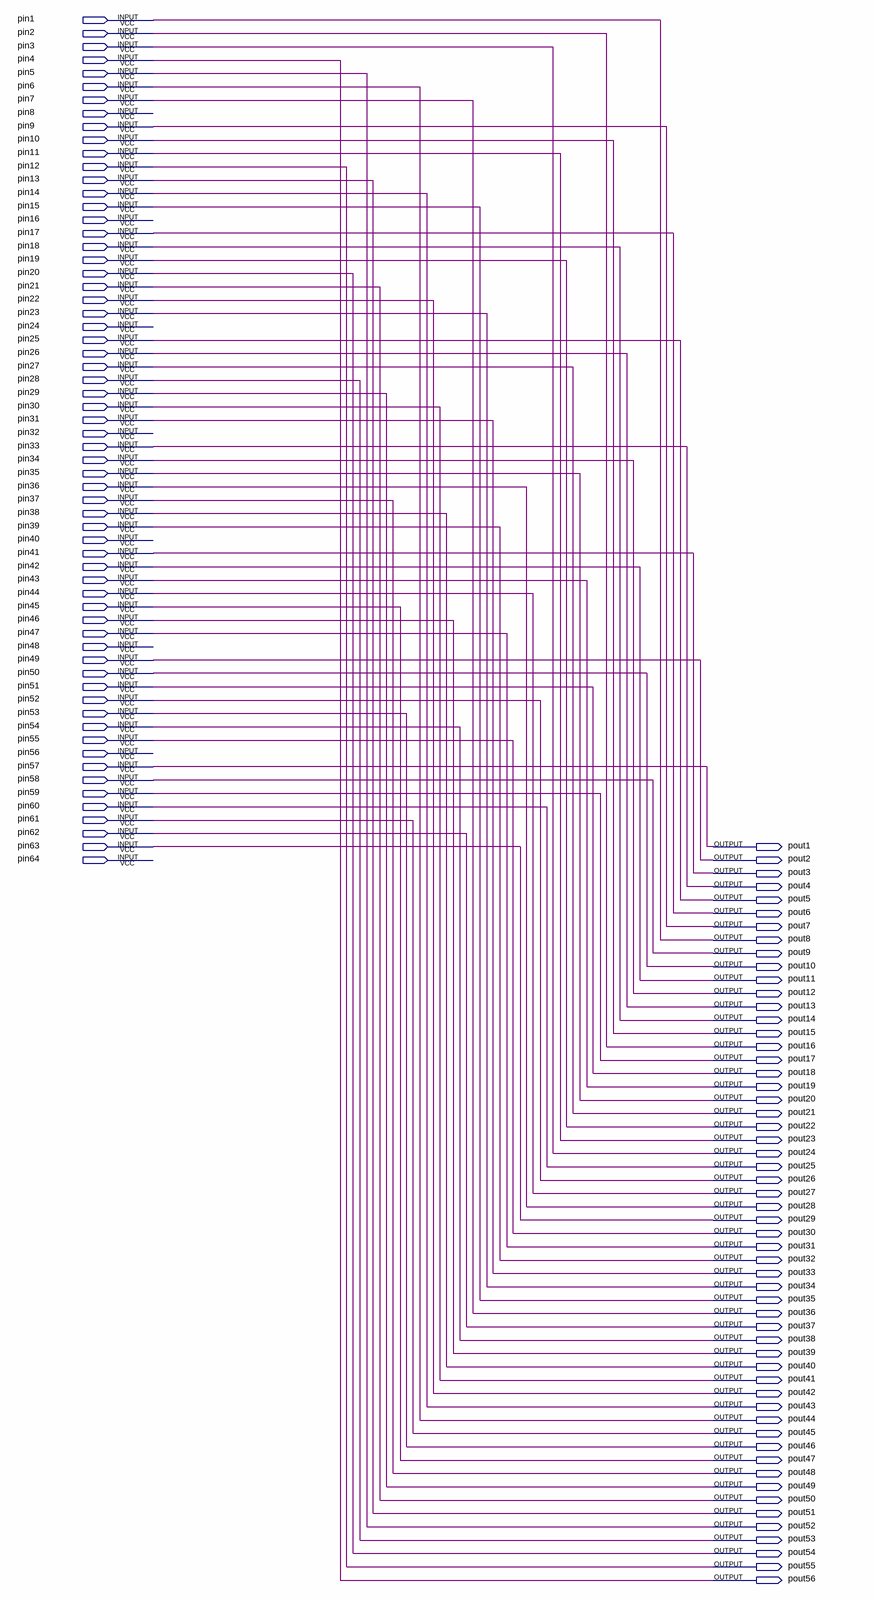
[diagram p0: schematic sheet]
// Quartus schematic PC_1.bdf as structural Verilog: 0 symbols, 120 pins
module PC_1 (
  input  pin1,
  input  pin2,
  input  pin3,
  input  pin4,
  input  pin5,
  input  pin6,
  input  pin7,
  input  pin8,
  input  pin9,
  input  pin10,
  input  pin11,
  input  pin12,
  input  pin13,
  input  pin14,
  input  pin15,
  input  pin16,
  input  pin17,
  input  pin18,
  input  pin19,
  input  pin20,
  input  pin21,
  input  pin22,
  input  pin23,
  input  pin24,
  input  pin25,
  input  pin26,
  input  pin27,
  input  pin28,
  input  pin29,
  input  pin30,
  input  pin31,
  input  pin32,
  input  pin33,
  input  pin34,
  input  pin35,
  input  pin36,
  input  pin37,
  input  pin38,
  input  pin39,
  input  pin40,
  input  pin41,
  input  pin42,
  input  pin43,
  input  pin44,
  input  pin45,
  input  pin46,
  input  pin47,
  input  pin48,
  input  pin49,
  input  pin50,
  input  pin51,
  input  pin52,
  input  pin53,
  input  pin54,
  input  pin55,
  input  pin56,
  input  pin57,
  input  pin58,
  input  pin59,
  input  pin60,
  input  pin61,
  input  pin62,
  input  pin63,
  input  pin64,
  output pout1,
  output pout2,
  output pout3,
  output pout4,
  output pout5,
  output pout6,
  output pout7,
  output pout8,
  output pout9,
  output pout10,
  output pout11,
  output pout12,
  output pout13,
  output pout14,
  output pout15,
  output pout16,
  output pout17,
  output pout18,
  output pout19,
  output pout20,
  output pout21,
  output pout22,
  output pout23,
  output pout24,
  output pout25,
  output pout26,
  output pout27,
  output pout28,
  output pout29,
  output pout30,
  output pout31,
  output pout32,
  output pout33,
  output pout34,
  output pout35,
  output pout36,
  output pout37,
  output pout38,
  output pout39,
  output pout40,
  output pout41,
  output pout42,
  output pout43,
  output pout44,
  output pout45,
  output pout46,
  output pout47,
  output pout48,
  output pout49,
  output pout50,
  output pout51,
  output pout52,
  output pout53,
  output pout54,
  output pout55,
  output pout56
);


  assign pout1 = pin57;
  assign pout2 = pin49;
  assign pout3 = pin41;
  assign pout4 = pin33;
  assign pout5 = pin25;
  assign pout6 = pin17;
  assign pout7 = pin9;
  assign pout8 = pin1;
  assign pout9 = pin58;
  assign pout10 = pin50;
  assign pout11 = pin42;
  assign pout12 = pin34;
  assign pout13 = pin26;
  assign pout14 = pin18;
  assign pout15 = pin10;
  assign pout16 = pin2;
  assign pout17 = pin59;
  assign pout18 = pin51;
  assign pout19 = pin43;
  assign pout20 = pin35;
  assign pout21 = pin27;
  assign pout22 = pin19;
  assign pout23 = pin11;
  assign pout24 = pin3;
  assign pout25 = pin60;
  assign pout26 = pin52;
  assign pout27 = pin44;
  assign pout28 = pin36;
  assign pout29 = pin63;
  assign pout30 = pin55;
  assign pout31 = pin47;
  assign pout32 = pin39;
  assign pout33 = pin31;
  assign pout34 = pin23;
  assign pout35 = pin15;
  assign pout36 = pin7;
  assign pout37 = pin62;
  assign pout38 = pin54;
  assign pout39 = pin46;
  assign pout40 = pin38;
  assign pout41 = pin30;
  assign pout42 = pin22;
  assign pout43 = pin14;
  assign pout44 = pin6;
  assign pout45 = pin61;
  assign pout46 = pin53;
  assign pout47 = pin45;
  assign pout48 = pin37;
  assign pout49 = pin29;
  assign pout50 = pin21;
  assign pout51 = pin13;
  assign pout52 = pin5;
  assign pout53 = pin28;
  assign pout54 = pin20;
  assign pout55 = pin12;
  assign pout56 = pin4;
endmodule
